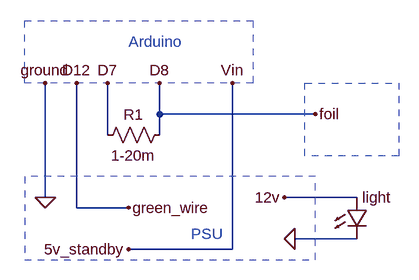
[diagram p0: schematic schema.asc]
schema.asc, the LTspice schematic file:
Version 4
SHEET 1 880 680
WIRE 160 144 160 96
WIRE 400 144 160 144
WIRE 80 176 80 96
WIRE 160 176 160 144
WIRE -16 272 -16 96
WIRE 464 272 352 272
WIRE 32 288 32 96
WIRE 112 288 32 288
WIRE 464 336 368 336
WIRE 272 352 272 96
WIRE 272 352 112 352
FLAG -16 272 0
FLAG 80 96 D7
FLAG 160 96 D8
FLAG 400 144 foil
FLAG 32 96 D12
FLAG -16 96 ground
FLAG 112 288 green_wire
FLAG 368 336 0
FLAG 352 272 12v
FLAG 112 352 5v_standby
FLAG 272 96 Vin
SYMBOL LED 448 272 R0
SYMATTR InstName light
SYMATTR Value ""
SYMBOL res 176 160 R90
WINDOW 0 0 56 VBottom 2
WINDOW 3 32 56 VTop 2
SYMATTR InstName R1
SYMATTR Value 1-20m
TEXT 208 328 Left 2 ;PSU
TEXT 112 32 Left 2 ;Arduino
RECTANGLE Normal -48 0 304 96 2
RECTANGLE Normal -48 368 400 240 2
RECTANGLE Normal 528 208 384 96 2

The netlist it stands for:
* schema.asc
D§light 12v 0
R1 foil D7 1-20m
.model D D
.lib standard.dio
* PSU
* Arduino
.backanno
.end